# EAGLE design BTS (EAGLE 8.6.0)
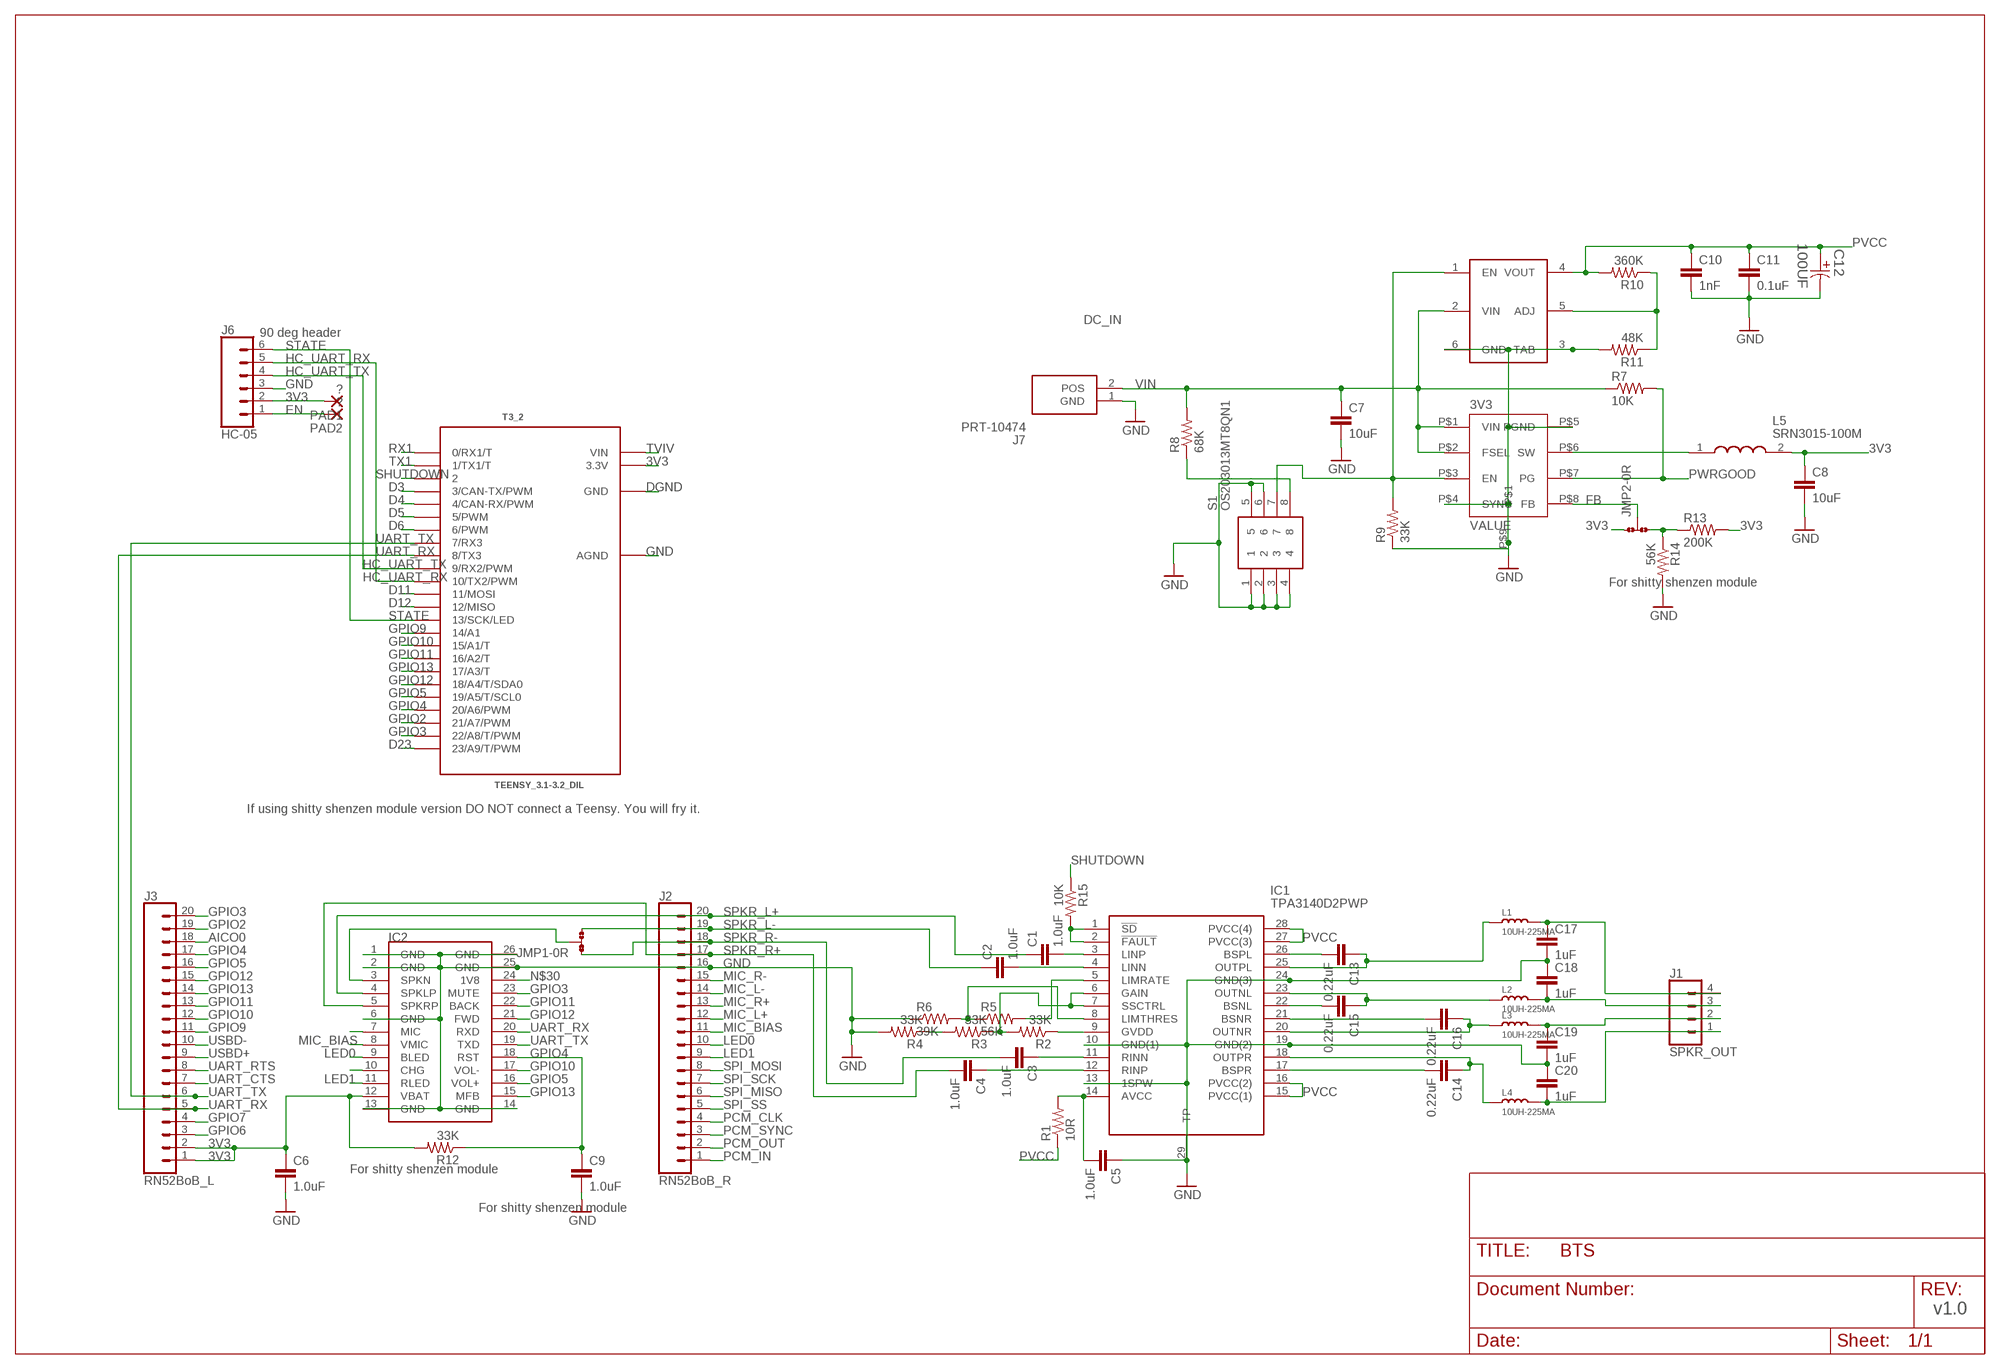
[diagram p0: schematic, sheet 1]

## Parts
3V3  ADP2370  [3MM_LFCSP_QFN]
C1  1.0uF  1.0UF-0603-16V-10%  [0603]
C2  1.0uF  1.0UF-0603-16V-10%  [0603]
C3  1.0uF  1.0UF-0603-16V-10%  [0603]
C4  1.0uF  1.0UF-0603-16V-10%  [0603]
C5  1.0uF  1.0UF-0603-16V-10%  [0603]
C6  1.0uF  1.0UF-0603-16V-10%  [0603]
C7  10uF  C-EUC3216  [C3216]
C8  10uF  C-EUC3216  [C3216]
C9  1.0uF  1.0UF-0603-16V-10%  [0603]
C10  1nF  1.0NF/1000PF-0603-50V-10%  [0603]
C11  0.1uF  0.1UF-0603-25V-(+80/-20%)  [0603]
C12  100UF  EEE-FK1C101P-CASE-D  [CAPAE660X610N]
C13  0.22uF  0.22UF-0603-50V-(-20/+80%)  [0603]
C14  0.22uF  0.22UF-0603-50V-(-20/+80%)  [0603]
C15  0.22uF  0.22UF-0603-50V-(-20/+80%)  [0603]
C16  0.22uF  0.22UF-0603-50V-(-20/+80%)  [0603]
C17  1uF  1.0NF/1000PF-0603-50V-10%  [0603]
C18  1uF  1.0NF/1000PF-0603-50V-10%  [0603]
C19  1uF  1.0NF/1000PF-0603-50V-10%  [0603]
C20  1uF  1.0NF/1000PF-0603-50V-10%  [0603]
IC1  TPA3140D2PWP  [SOP65P640X120-29N]
IC2  BLK-MD-SPK-B  [BLK-MD-SPK-B]
J1  SPKR_OUT  CONN_04SCREW  [SCREWTERMINAL-3.5MM-4]
J2  RN52BoB_R  CONN_20  [1X20]
J3  RN52BoB_L  CONN_20  [1X20]
J6  HC-05  CONN_06SILK_FEMALE_PTH  [1X06]
J7  PRT-10474  [SHDR2W320P716_1X2_1574X813X158]
JMP1  0R-JUMPA  [A0R-JMP]
JMP2  0R-JUMPA  [A0R-JMP]
L1  10UH-225MA  SMD-INDUCTOR-10UH-225MA-10%(0806)  [L0806]
L2  10UH-225MA  SMD-INDUCTOR-10UH-225MA-10%(0806)  [L0806]
L3  10UH-225MA  SMD-INDUCTOR-10UH-225MA-10%(0806)  [L0806]
L4  10UH-225MA  SMD-INDUCTOR-10UH-225MA-10%(0806)  [L0806]
L5  SRN3015-100M  [SRN3015]
PAD1  ?  SMD2  [SMD1,27-2,54]
PAD2  ?  SMD2  [SMD1,27-2,54]
R1  10R  R-US_R0603  [R0603]
R2  33K  R-US_R0603  [R0603]
R3  33K  R-US_R0603  [R0603]
R4  33K  R-US_R0603  [R0603]
R5  56K  R-US_R0603  [R0603]
R6  39K  R-US_R0603  [R0603]
R7  10K  R-US_R0603  [R0603]
R8  68K  R-US_R0603  [R0603]
R9  33K  R-US_R0603  [R0603]
R10  360K  R-US_R0603  [R0603]
R11  48K  R-US_R0603  [R0603]
R12  33K  R-US_R0603  [R0603]
R13  200K  R-US_R0603  [R0603]
R14  56K  R-US_R0603  [R0603]
R15  10K  R-US_R0603  [R0603]
S1  OS203013MT8QN1  [OS203013MT8QN1]
T3_2  TEENSY_3.1-3.2_DIL  [TEENSY_3.0-3.2&LC_DIL]
U$2  NCP59302  [D2PAK-5]

## Nets
3V3: C6.1 C8.1 IC2.12(VBAT) J3.1 J3.2 J6.2 JMP2.1 L5.2 PAD1.1(P) R12.2 R13.2 T3_2.3.3V
AICO0: J3.18
BSNL: C15.2 IC1.22(BSNL)
BSNR: C16.2 IC1.21(BSNR)
BSPL: C13.2 IC1.26(BSPL)
BSPR: C14.2 IC1.17(BSPR)
D3: T3_2.3(3/CAN-TX/PWM)
D4: T3_2.4(4/CAN-RX/PWM)
D5: T3_2.5(5/PWM)
D6: T3_2.6(6/PWM)
D11: T3_2.11(11/MOSI)
D12: T3_2.12(12/MISO)
D23: T3_2.23/A9(23/A9/T/PWM)
DGND: T3_2.GND
EN: J6.1 PAD2.1(P)
FB: 3V3.P$8(FB) JMP2.2
GAIN: IC1.6(GAIN) IC1.7(SSCTRL) R2.2 R3.1
GND: 3V3.P$4(SYNC) 3V3.P$5(PGND) 3V3.P$9 C5.1 C6.2 C7.2 C8.2 C9.2 C10.2 C11.2 C12.2 C17.2 C18.1 C19.2 C20.1 IC1.10(GND(1)) IC1.13(1SPW) IC1.19(GND(2)) IC1.24(GND(3)) IC1.29(TP) IC2.1(GND) IC2.2(GND) IC2.6(GND) IC2.13(GND) IC2.14(GND) IC2.25(GND) IC2.26(GND) J2.16 J6.3 J7.1(GND) R4.2 R6.1 R9.1 R11.2 R14.2 S1.1 S1.2 S1.3 S1.4 S1.5 S1.6 T3_2.AGND U$2.3(TAB) U$2.6(GND)
GPIO2: J3.19 T3_2.21/A7(21/A7/PWM)
GPIO3: IC2.23(MUTE) J3.20 T3_2.22/A8(22/A8/T/PWM)
GPIO4: C9.1 IC2.18(RST) J3.17 R12.1 T3_2.20/A6(20/A6/PWM)
GPIO5: IC2.16(VOL+) J3.16 T3_2.19/A5(19/A5/T/SCL0)
GPIO6: J3.3
GPIO7: J3.4
GPIO9: J3.11 T3_2.14/A0(14/A1)
GPIO10: IC2.17(VOL-) J3.12 T3_2.15/A1(15/A1/T)
GPIO11: IC2.22(BACK) J3.13 T3_2.16/A2(16/A2/T)
GPIO12: IC2.21(FWD) J3.15 T3_2.18/A4(18/A4/T/SDA0)
GPIO13: IC2.15(MFB) J3.14 T3_2.17/A3(17/A3/T)
GVDD: IC1.9(GVDD) R2.1
HC_UART_RX: J6.5 T3_2.10(10/TX2/PWM)
HC_UART_TX: J6.4 T3_2.9(9/RX2/PWM)
LED0: IC2.9(BLED) J2.10
LED1: IC2.11(RLED) J2.9
LIMRATE: IC1.5(LIMRATE) R5.2
LIMTHRES: IC1.8(LIMTHRES) R5.1 R6.2
LINN: C2.2 IC1.4(LINN)
LINP: C1.2 IC1.3(LINP)
MIC_BIAS: IC2.8(VMIC) J2.11
MIC_L+: J2.12
MIC_L-: J2.14
MIC_R+: J2.13
MIC_R-: J2.15
N$1: C5.2 IC1.14(AVCC) R1.2
N$2: IC1.1(!SD) IC1.2(!FAULT) R15.2
N$3: R3.2 R4.1
N$16: IC2.7(MIC)
N$19: C17.1 J1.4 L1.2
N$20: C18.2 J1.3 L2.2
N$21: C19.1 J1.2 L3.2
N$22: C20.2 J1.1 L4.2
N$23: JMP2.3 R13.1 R14.1
N$26: IC2.10(CHG)
N$28: IC2.3(SPKN) JMP1.2
N$30: IC2.24(1V8)
N$63: 3V3.P$3(EN) R9.2 S1.7 U$2.1(EN)
N$64: 3V3.P$6(SW) L5.1
N$65: R8.1 S1.8
N$66: R10.1 R11.1 U$2.5(ADJ)
OUTNL: C15.1 IC1.23(OUTNL) L2.1
OUTNR: C16.1 IC1.20(OUTNR) L3.1
OUTPL: C13.1 IC1.25(OUTPL) L1.1
OUTPR: C14.1 IC1.18(OUTPR) L4.1
PCM_CLK: J2.4
PCM_IN: J2.1
PCM_OUT: J2.2
PCM_SYNC: J2.3
PVCC: C10.1 C11.1 C12.1 IC1.15(PVCC(1)) IC1.16(PVCC(2)) IC1.27(PVCC(3)) IC1.28(PVCC(4)) R1.1 R10.2 U$2.4(VOUT)
PWRGOOD: 3V3.P$7(PG) R7.2
RINN: C3.1 IC1.11(RINN)
RINP: C4.1 IC1.12(RINP)
RX1: T3_2.0(0/RX1/T)
SHUTDOWN: R15.1 T3_2.2
SPI_MISO: J2.6
SPI_MOSI: J2.8
SPI_SCK: J2.7
SPI_SS: J2.5
SPKR_L+: C1.1 IC2.4(SPKLP) J2.20
SPKR_L-: C2.1 J2.19 JMP1.3
SPKR_R+: C4.2 IC2.5(SPKRP) J2.17
SPKR_R-: C3.2 J2.18 JMP1.1
STATE: J6.6 T3_2.13(13/SCK/LED)
TVIV: T3_2.VIN
TX1: T3_2.1(1/TX1/T)
UART_CTS: J3.7
UART_RTS: J3.8
UART_RX: IC2.20(RXD) J3.5 T3_2.8(8/TX3)
UART_TX: IC2.19(TXD) J3.6 T3_2.7(7/RX3)
USBD+: J3.9
USBD-: J3.10
VIN: 3V3.P$1(VIN) 3V3.P$2(FSEL) C7.1 J7.2(POS) R7.1 R8.2 U$2.2(VIN)

## Notes on the sheet
- DC_IN
- 90 deg header
- For shitty shenzen module
- If using shitty shenzen module version DO NOT connect a Teensy. You will fry it.
- For shitty shenzen module
- For shitty shenzen module
- v1.0

## Library data of the parts
3V3 = myLib:ADP2370
C1-C6 C9 = SparkFun-Capacitors:1.0UF: 1µF ceramic capacitors A capacitor is a passive two-terminal electrical component used to store electrical energy temporarily in an electric field.; PROD_ID: CAP-00868
C7 = rcl:C-EU: CAPACITOR, European symbol; SPICEPREFIX: 10uF
C8 = rcl:C-EU: CAPACITOR, European symbol; SPICEPREFIX: C
C10 = SparkFun-Capacitors:1.0NF/1000PF: 1nF/1,000pF ceramic capacitors A capacitor is a passive two-terminal electrical component used to store electrical energy temporarily in an electric field.; PROD_ID: CAP-07886
C11 = SparkFun-Capacitors:0.1UF: 0.1µF ceramic capacitors A capacitor is a passive two-terminal electrical component used to store electrical energy temporarily in an electric field.; PROD_ID: CAP-00810
C12 = Panasonic-EEEFK_EEEFP:EEE-: Aluminum Electrolytic Capacitors,Surface Mount Type; MPN: EEE-FK1C101P; OC_FARNELL: 9695672; OC_NEWARK: 80K9525; PACKAGE: CASE-D; SUPPLIER: PANASONIC; TOLERANCE: ±20 %; VOLTAGERATING: 16V
C13-C16 = SparkFun-Capacitors:0.22UF: 0.22µF ceramic capacitors A capacitor is a passive two-terminal electrical component used to store electrical energy temporarily in an electric field.; PROD_ID: CAP-09885
C17-C20 = SparkFun-Capacitors:1.0NF/1000PF: 1nF/1,000pF ceramic capacitors A capacitor is a passive two-terminal electrical component used to store electrical energy temporarily in an electric field.; PROD_ID: CAP-07886; VALUE: 1nF
IC1 = TPA3140D2PWP:TPA3140D2PWP: Audio Amplifiers 10W Class-D Audio Amp Source: Datasheet <http://www.mouser.com/ds/2/405/tpa3140d2-558212.pdf>; DESCRIPTION: Audio Amplifiers 10W Class-D Audio Amp; HEIGHT: 1.2mm; MANUFACTURER_NAME: Texas Instruments; MANUFACTURER_PART_NUMBER: TPA3140D2PWP; SUPPLIER_NAME: RS
IC2 = BLK-MD-SPK-B:BLK-MD-SPK-B
J1 = SparkFun-Connectors:CONN_04: Multi connection point. Often used as Generic Header-pin footprint for 0.1 inch spaced/style header connections On any of the 0.1 inch spaced packages, you can populate with these: Break Away Headers - Straight <https://www.sparkfun.com/products/116> (PRT-00116) Break Away Male Headers - Right Angle <https://www.sparkfun.com/products/553> (PRT-00553) Female Headers <https://www.sparkfun.com/products/115> (PRT-00115) Break Away Headers - Machine Pin <https://www.sparkfun.com/products/117> (PRT-00117) Break Away Female Headers - Swiss Machine Pin <https://www.sparkfun.com/products/743> (PRT-00743) For SCREWTERMINALS and SPRING TERMINALS visit here: Screw Terimnals on SparkFun.com <https://www.sparkfun.com/search/results?term=Screw+Terminals> (5mm/3.5mm/2.54mm spacing) This device is also useful as a general connection point to wire up your design to another part of your project. Our various solder wires solder well into these plated through hole pads. Hook-Up Wire - Assortment (Stranded, 22 AWG) <https://www.sparkfun.com/products/11375> (PRT-11375) Hook-Up Wire - Assortment (Solid Core, 22 AWG) <https://www.sparkfun.com/products/11367> (PRT-11367) View the entire wire category on our website here <https://www.sparkfun.com/categories/141> Special notes: Molex polarized connector foot print use with SKU : PRT-08231 with associated crimp pins and housings. 1MM SMD Version SKU: PRT-10208; PROD_ID: 2xCONN-08399; SF_ID: 2xPRT-08084
J2 J3 = SparkFun-Connectors:CONN_20: Multi connection point. Often used as Generic Header-pin footprint for 0.1 inch spaced/style header connections On any of the 0.1 inch spaced packages, you can populate with these: Break Away Headers - Straight <https://www.sparkfun.com/products/116> (PRT-00116) Break Away Male Headers - Right Angle <https://www.sparkfun.com/products/553> (PRT-00553) Female Headers <https://www.sparkfun.com/products/115> (PRT-00115) Break Away Headers - Machine Pin <https://www.sparkfun.com/products/117> (PRT-00117) Break Away Female Headers - Swiss Machine Pin <https://www.sparkfun.com/products/743> (PRT-00743) For SCREWTERMINALS and SPRING TERMINALS visit here: Screw Terimnals on SparkFun.com <https://www.sparkfun.com/search/results?term=Screw+Terminals> (5mm/3.5mm/2.54mm spacing) This device is also useful as a general connection point to wire up your design to another part of your project. Our various solder wires solder well into these plated through hole pads. Hook-Up Wire - Assortment (Stranded, 22 AWG) <https://www.sparkfun.com/products/11375> (PRT-11375) Hook-Up Wire - Assortment (Solid Core, 22 AWG) <https://www.sparkfun.com/products/11367> (PRT-11367) View the entire wire category on our website here <https://www.sparkfun.com/categories/141> Special notes: Molex polarized connector foot print use with SKU : PRT-08231 with associated crimp pins and housings. 1MM SMD Version SKU: PRT-10208 NOTES ON THE VARIANTS LOCK and LOCK_LONGPADS... This footprint was designed to help hold the alignment of a through-hole component (i.e. 6-pin header) while soldering it into place. You may notice that each hole has been shifted either up or down by 0.005 of an inch from it's more standard position (which is a perfectly straight line). This slight alteration caused the pins (the squares in the middle) to touch the edges of the holes. Because they are alternating, it causes a "brace" to hold the component in place. 0.005 has proven to be the perfect amount of "off-center" position when using our standard breakaway headers. Although looks a little odd when you look at the bare footprint, once you have a header in there, the alteration is very hard to notice. Also,if you push a header all the way into place, it is covered up entirely on the bottom side. Note about LOCK SPECIAL package: This is just like the LOCK variant in that the holes are staggared by 5 mil, but except for the last two holes. They are not altered from the "standard" footprint layout. This is used for a special purpose on the layout of our Graphic LCD Backpack. Make sure you want to use this device before selecting it for you project!
J6 = SparkFun-Connectors:CONN_06: Multi connection point. Often used as Generic Header-pin footprint for 0.1 inch spaced/style header connections On any of the 0.1 inch spaced packages, you can populate with these: Break Away Headers - Straight <https://www.sparkfun.com/products/116> (PRT-00116) Break Away Male Headers - Right Angle <https://www.sparkfun.com/products/553> (PRT-00553) Female Headers <https://www.sparkfun.com/products/115> (PRT-00115) Break Away Headers - Machine Pin <https://www.sparkfun.com/products/117> (PRT-00117) Break Away Female Headers - Swiss Machine Pin <https://www.sparkfun.com/products/743> (PRT-00743) Arduino Stackable Header - 6 Pin <https://www.sparkfun.com/products/9280> (PRT-09280) For SCREWTERMINALS and SPRING TERMINALS visit here: Screw Terimnals on SparkFun.com <https://www.sparkfun.com/search/results?term=Screw+Terminals> (5mm/3.5mm/2.54mm spacing) This device is also useful as a general connection point to wire up your design to another part of your project. Our various solder wires solder well into these plated through hole pads. Hook-Up Wire - Assortment (Stranded, 22 AWG) <https://www.sparkfun.com/products/11375> (PRT-11375) Hook-Up Wire - Assortment (Solid Core, 22 AWG) <https://www.sparkfun.com/products/11367> (PRT-11367) View the entire wire category on our website here <https://www.sparkfun.com/categories/141>; PROD_ID: CONN-08437
J7 = PRT-10474:PRT-10474: Soldering Workstation Equipment XT60 Connectors Male/Female Pair Source: Datasheet <http://cdn.sparkfun.com/datasheets/Prototyping/xt60.pdf>; DESCRIPTION: Soldering Workstation Equipment XT60 Connectors Male/Female Pair; HEIGHT: 15.875mm; MANUFACTURER_NAME: SparkFun; MANUFACTURER_PART_NUMBER: PRT-10474; SUPPLIER_NAME: RS
JMP1 JMP2 = jump-0r-smd:0R-JUMP: SMD 0R 0805 Jumper
L1-L4 = Seeed-Inductor:SMD-INDUCTOR-10UH-225MA-10%(0806): 303010042; MPN: LQH2MCN100K02L
L5 = SRN3015-100M:SRN3015-100M: Power Inductor semi-shielded SMD 10uH Bourns SRN3015 Series Shielded Wire-wound SMD Inductor with a Ferrite Core, 10 H 20% Wire-Wound 1A Idc Source: Datasheet <https://componentsearchengine.com/Datasheets/3/SRN3015-100M.pdf>; DESCRIPTION: Power Inductor semi-shielded SMD 10uH Bourns SRN3015 Series Shielded Wire-wound SMD Inductor with a Ferrite Core, 10 H 20% Wire-Wound 1A Idc; HEIGHT: mm; MANUFACTURER_NAME: Bourns; MANUFACTURER_PART_NUMBER: SRN3015-100M; RS_PART_NUMBER: 7435071; SUPPLIER_NAME: RS
PAD1 PAD2 = wirepad:SMD2: SMD PAD
R1 = resistor:R-US_: RESISTOR, American symbol; RESISTANCE: 10R
R2-R4 R9 R12 R15 = resistor:R-US_: RESISTOR, American symbol; RESISTANCE: 33K
R5 = resistor:R-US_: RESISTOR, American symbol; RESISTANCE: 56K
R6 = resistor:R-US_: RESISTOR, American symbol; RESISTANCE: 39K
R7 R10 R11 R13 R14 = resistor:R-US_: RESISTOR, American symbol; RESISTANCE: 10K
R8 = resistor:R-US_: RESISTOR, American symbol; RESISTANCE: 68K
S1 = OS203013MT8QN1:OS203013MT8QN1: OS Series Miniature Slide Switches, DP3T. Source: Datasheet <http://www.ckswitches.com/media/1428/os.pdf>; DESCRIPTION: OS Series Miniature Slide Switches, DP3T.; HEIGHT: mm; MANUFACTURER_NAME: C & K COMPONENTS; MANUFACTURER_PART_NUMBER: OS203013MT8QN1; SUPPLIER_NAME: RS
T3_2 = Teensy_3_and_LC_Series_Boards_v1.4:TEENSY_3.1-3.2_DIL: Teensy 3.1 or 3.2 in a DIL Layout.
U$2 = myLib:NCP59302

## Board
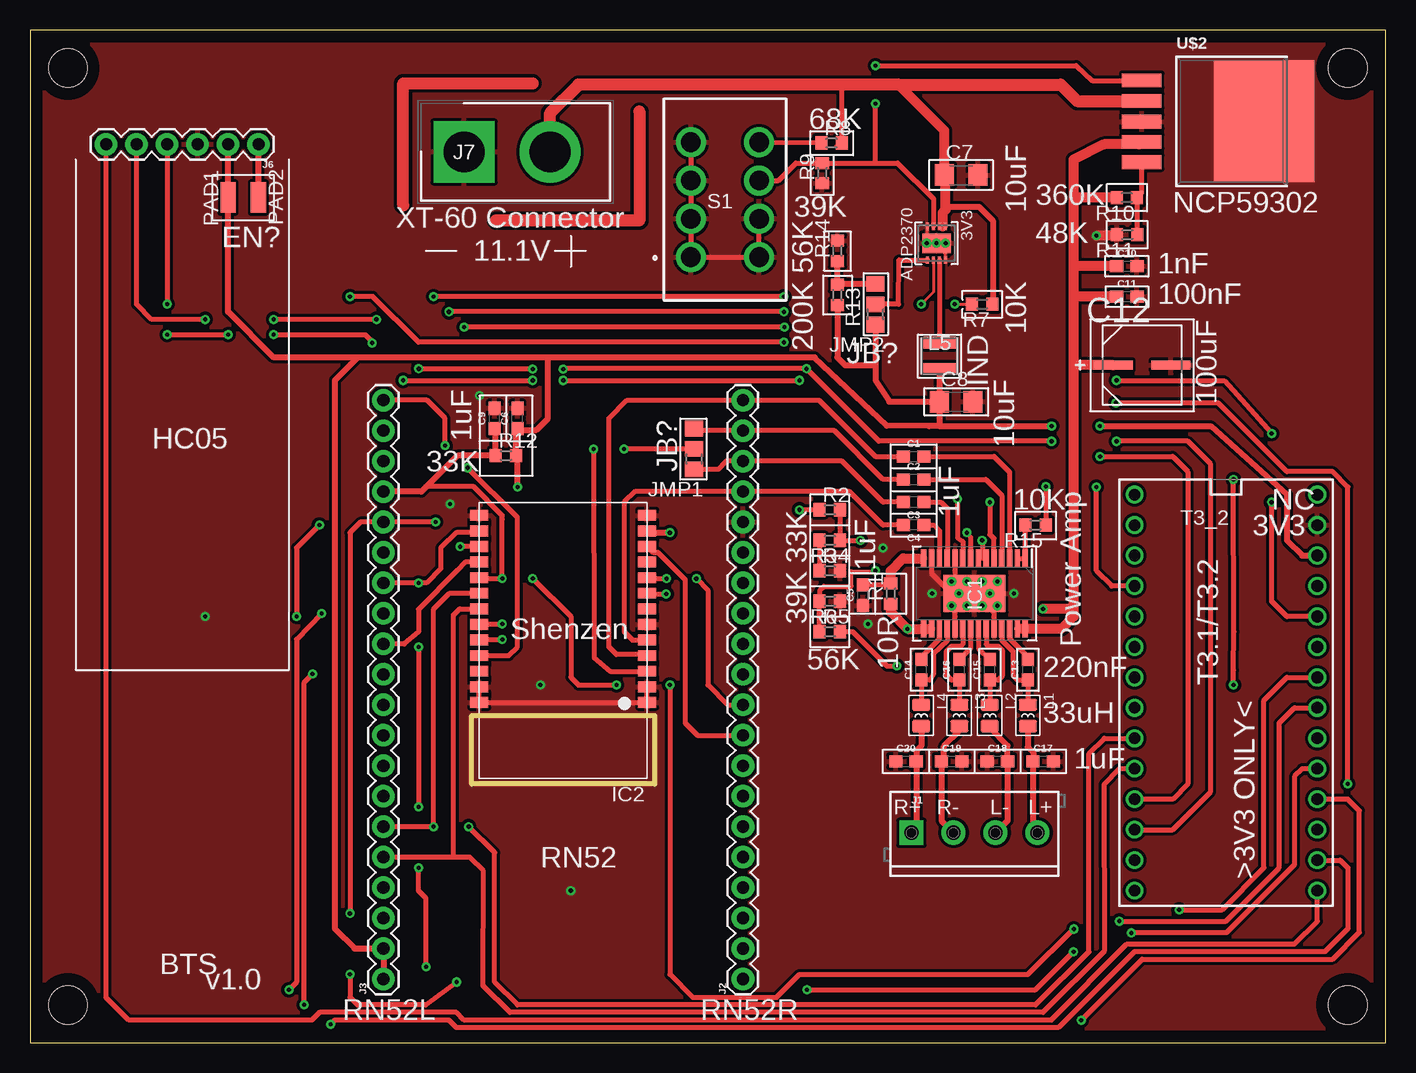
[diagram p1: board, top side]
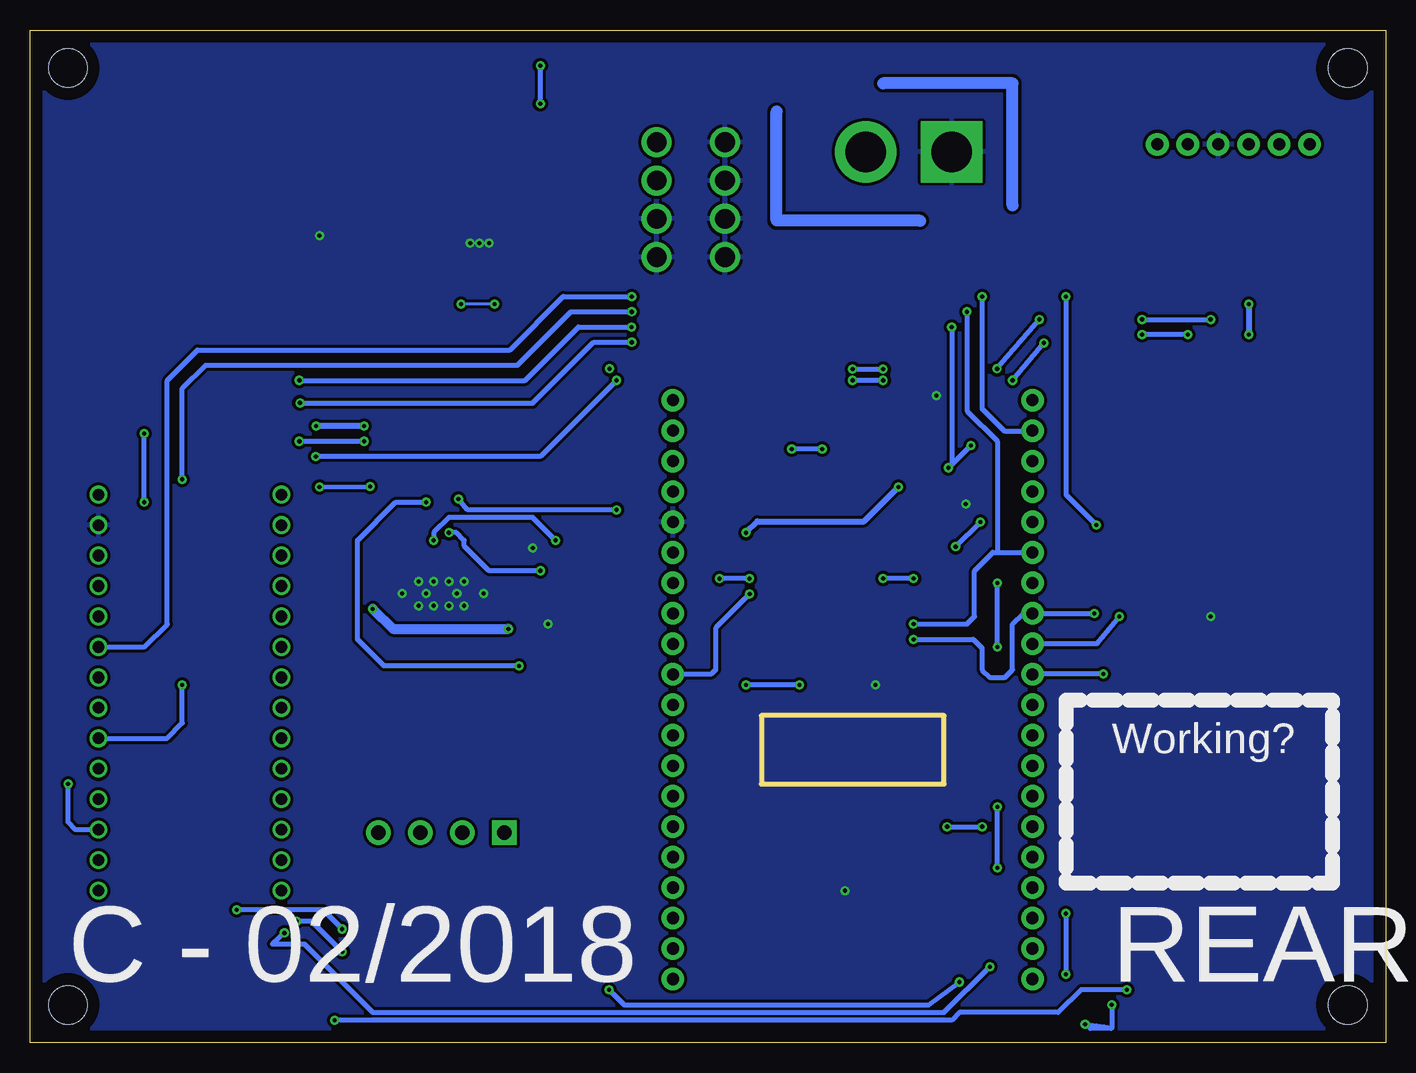
[diagram p2: board, bottom side, seen from below]

Size 113.03 x 84.46 mm. Coordinates in mm from the lower left corner, seen from the top.
Outline: 0,0 113.03,0 113.03,84.46 0,84.45 0,0
Copper layers (1*16): Top 0.035mm / dielectric 1.5mm / Bottom 0.035mm
Design rules "PCBCart *": minimum track width 6mil, minimum drill 8mil, track to track 6mil, track to pad 6mil, pad to pad 6mil, via to via 6mil, smd to smd 6mil, copper to edge 40mil, drill to drill 6mil, minimum pad ring 10mil, minimum via ring 8mil, stop-mask expansion 5mil, vias tented up to drill 0mil, thermal gap 10mil
Holes 3.2 mm at 3.17,81.28 109.86,81.28 3.17,3.17 109.86,3.17
Milling: area 36.8,21.6 to 52.1,27.3

### Footprints (pad centres in the part's own frame; a part is rotated, then mirrored left to right if it is on the bottom)
3MM_LFCSP_QFN = smd 0.6 x 0.25: P$1 -1.4,0.75; P$2 -1.4,0.25; P$3 -1.4,-0.25; P$4 -1.4,-0.75; P$5 1.4,0.75; P$6 1.4,0.25; P$7 1.4,-0.25; P$8 1.4,-0.75 | smd 1.64 x 2.38: P$9 0,0
0603 = smd 1.1 x 1: 1 -0.85,0; 2 0.85,0
C3216 = smd 1.6 x 1.8: 1 -1.4,0; 2 1.4,0
CAPAE660X610N = smd 3.251 x 0.762: 1 -2.413,0; 2 2.413,0
SOP65P640X120-29N = smd 1.475 x 0.45: 1 -2.938,4.225; 2 -2.938,3.575; 3 -2.938,2.925; 4 -2.938,2.275; 5 -2.938,1.625; 6 -2.938,0.975; 7 -2.938,0.325; 8 -2.938,-0.325; 9 -2.938,-0.975; 10 -2.938,-1.625; 11 -2.938,-2.275; 12 -2.938,-2.925; 13 -2.938,-3.575; 14 -2.938,-4.225; 15 2.938,-4.225; 16 2.938,-3.575; 17 2.938,-2.925; 18 2.938,-2.275; 19 2.938,-1.625; 20 2.938,-0.975; 21 2.938,-0.325; 22 2.938,0.325; 23 2.938,0.975; 24 2.938,1.625; 25 2.938,2.275; 26 2.938,2.925; 27 2.938,3.575; 28 2.938,4.225 | smd 3.1 x 5.18: 29 0,0
BLK-MD-SPK-B = smd 1.5 x 0.9: 1 -7,7.8; 2 -7,6.5; 3 -7,5.2; 4 -7,3.9; 5 -7,2.6; 6 -7,1.3; 7 -7,0; 8 -7,-1.3; 9 -7,-2.6; 10 -7,-3.9; 11 -7,-5.2; 12 -7,-6.5; 13 -7,-7.8; 14 7,-7.8; 15 7,-6.5; 16 7,-5.2; 17 7,-3.9; 18 7,-2.6; 19 7,-1.3; 20 7,0; 21 7,1.3; 22 7,2.6; 23 7,3.9; 24 7,5.2; 25 7,6.5; 26 7,7.8
SCREWTERMINAL-3.5MM-4 = drill 1.2 pad 2.032 square: 1 0,0 | drill 1.2 pad 2.032: 2 3.5,0; 3 7,0; 4 10.5,0
1X20 = drill 1.016 pad 1.88: 1 0,0; 2 2.54,0; 3 5.08,0; 4 7.62,0; 5 10.16,0; 6 12.7,0; 7 15.24,0; 8 17.78,0; 9 20.32,0; 10 22.86,0; 11 25.4,0; 12 27.94,0; 13 30.48,0; 14 33.02,0; 15 35.56,0; 16 38.1,0; 17 40.64,0; 18 43.18,0; 19 45.72,0; 20 48.26,0
1X06 = drill 1.016 pad 1.88: 1 0,0; 2 2.54,0; 3 5.08,0; 4 7.62,0; 5 10.16,0; 6 12.7,0
SHDR2W320P716_1X2_1574X813X158 = drill 3.4 pad 5.1 square: 1 0,0 | drill 3.4 pad 5.1: 2 7.163,0
A0R-JMP = smd 1.5 x 1.3: 1 0,1.7; 2 0,0; 3 0,-1.7
L0806 = smd 1.016 x 1.524: 1 -0.889,0; 2 0.889,0
SRN3015 = smd 2.7 x 1: 1 0,-1.1; 2 0,1.1
SMD1,27-2,54 = smd 1.27 x 2.54: 1 0,0
R0603 = smd 1 x 1.1: 1 -0.85,0; 2 0.85,0
OS203013MT8QN1 = drill 1.65 pad 2.5: 1 -2.85,-4.8; 2 -2.85,-1.6; 3 -2.85,1.6; 4 -2.85,4.8; 5 2.85,-4.8; 6 2.85,-1.6; 7 2.85,1.6; 8 2.85,4.8
TEENSY_3.0-3.2&LC_DIL = drill 0.965: 0 -7.62,13.97; 1 -7.62,11.43; 2 -7.62,8.89; 3 -7.62,6.35; 3.3V 7.62,11.43; 4 -7.62,3.81; 5 -7.62,1.27; 6 -7.62,-1.27; 7 -7.62,-3.81; 8 -7.62,-6.35; 9 -7.62,-8.89; 10 -7.62,-11.43; 11 -7.62,-13.97; 12 -7.62,-16.51; 13 7.62,-16.51; 14/A0 7.62,-13.97; 15/A1 7.62,-11.43; 16/A2 7.62,-8.89; 17/A3 7.62,-6.35; 18/A4 7.62,-3.81; 19/A5 7.62,-1.27; 20/A6 7.62,1.27; 21/A7 7.62,3.81; 22/A8 7.62,6.35; 23/A9 7.62,8.89; AGND 7.62,13.97; GND -7.62,16.51; VIN 7.62,16.51
D2PAK-5 = smd 1.143 x 3.302: 1 -3.404,-7.658; 2 -1.702,-7.658; 4 1.702,-7.658; 5 3.404,-7.658; 6 0.025,-7.658 | smd 10.16 x 8.382: 3 0,2.54

### Placement (x,y rotation side)
3V3  75.56,66.67 270 top
C1  73.66,48.9 0 top
C2  73.66,46.99 0 top
C3  73.66,45.09 180 top
C4  73.66,43.18 180 top
C5  69.44,37.34 90 top
C6  40.64,52.07 90 top
C7  77.62,72.36 0 top
C8  77.22,53.47 0 top
C9  38.73,52.07 90 top
C10  91.44,64.77 0 top
C11  91.44,62.23 0 top
C12  92.71,56.52 0 top
C13  83.19,31.11 90 top
C14  74.3,31.11 90 top
C15  80.01,31.11 90 top
C16  77.47,31.11 90 top
C17  84.45,23.5 0 top
C18  80.64,23.5 0 top
C19  76.83,23.5 0 top
C20  73.03,23.5 0 top
IC1  78.74,37.47 270 top
IC2  44.45,36.2 180 top
J1  73.48,17.53 0 top
J2  59.44,5.33 90 top
J3  29.46,5.33 90 top
J6  19.05,74.93 180 top
J7  36.2,74.3 0 top
JMP1  55.37,49.53 180 top
JMP2  70.48,61.59 180 top
L1  83.19,27.3 270 top
L2  80.01,27.3 270 top
L3  77.47,27.3 270 top
L4  74.3,27.3 270 top
L5  75.82,57.28 180 top
PAD1  16.51,70.48 0 top
PAD2  19.05,70.48 180 top
R1  71.75,37.47 90 top
R2  66.67,44.45 0 top
R3  66.67,41.91 180 top
R4  66.67,39.37 0 top
R5  66.67,34.29 0 top
R6  66.67,36.83 180 top
R7  79.38,61.59 180 top
R8  66.83,75.03 0 top
R9  66.04,72.52 90 top
R10  91.44,70.48 180 top
R11  91.47,67.39 180 top
R12  39.67,48.97 0 top
R13  67.31,62.36 270 top
R14  67.31,66.04 90 top
R15  83.82,43.18 180 top
S1  57.94,70.31 0 top
T3_2  99.69,29.21 0 top
U$2  100.33,76.83 270 top

### Tracks (layer width: path | path; a pad name or v marks a point on that pad's centre or on a via)
3V3  (via drill 0.35)
  Top 0.254: C8.1
  Top 0.508: JMP2.1 70.48,56.52 | 70.48,56.52 70.48,55.24 71.63,53.47 C8.1 75.82,51.43 | R13.2 67.31,57.15 67.94,56.52 70.48,56.52 | L5.2 C8.1 | 43.18,57.15 65.41,57.15 71.42,51.46 74.95,51.44 75.82,51.43 | 43.18,57.15 27.3,57.15 | J6.2 PAD1.1 16.51,60.96 20.32,57.15 27.3,57.15 | 27.3,57.15 25.4,55.24 25.4,9.53 27.05,7.87 J3.2 J3.1 | IC2.12 51.6,42.55 v53.34,42.55 | v40.64,46.35 40.64,48.86 R12.2 40.52,51.1 | 40.52,51.1 C6.1 | 40.52,51.1 42.22,51.1 43.18,52.07 43.18,57.15 | 75.82,51.43 76.85,51.44 v85.17,51.44 | v89.18,51.44 98.42,51.44 104.78,45.74 104.78,41.91 106.05,40.64 T3_2.3.3V
  Bottom 0.508: v53.34,42.55 52.39,43.5 43.5,43.5 v40.64,46.35 | v85.17,51.44 v89.18,51.44
BSNL
  Top 0.406: IC1.22 79.06,32.91 C15.2
BSNR
  Top 0.406: IC1.21 78.42,32.91 C16.2
BSPL
  Top 0.406: IC1.26 81.69,34.51 81.69,33.69 83.19,32.19 C13.2
BSPR
  Top 0.406: IC1.17 75.79,34.51 75.79,33.69 74.3,32.19 C14.2
EN
  Top 0.508: PAD2.1 J6.1
FB
  Top 0.406: JMP2.2 72.42,61.59 72.43,65.27 72.44,65.28 3V3.P$8
GAIN  (via drill 0.35)
  Top 0.406: v69.22,41.91 R3.1 R2.2 | v79.38,41.91 79.38,40.74 IC1.6 IC1.7
  Bottom 0.406: v69.22,41.91 71.12,43.81 78.11,43.81 79.38,42.55 v79.38,41.91
GND  (via drill 0.35)
  Top 0.152: 77.11,35.56 77.11,35.84 IC1.29 77.11,39.09 77.11,39.37
  Top 0.254: 3V3.P$9 v74.75,66.67 | 3V3.P$9 76.2,66.67 v76.33,66.67 v76.32,66.67 76.32,65.92 | 3V3.P$9 74.81,67.42 3V3.P$4 | 3V3.P$9 76.32,65.92 | 76.32,65.92 76.32,65.28 3V3.P$5
  Top 0.406: S1.4 S1.3 S1.2 S1.1 S1.5 S1.6 | IC1.19 77.11,35.56 77.11,35.88 | IC1.10 77.11,39.37 77.11,39.05 | IC1.13 75.17,39.13 76.37,37.93 | IC1.24 80.36,35.88 78.78,37.47 IC1.29 | IC2.25 IC2.26 IC2.1 IC2.2 | IC1.29 v78.11,38.48 | IC1.29 v79.38,38.48 | IC1.29 v80.01,37.47 | IC1.29 v78.11,36.45 | IC1.29 v79.38,36.45 | 76.31,66.56 76.2,66.67 | 74.81,66.74 v74.75,66.67
  Top 0.813: R11.2 90.54,67.31 v88.9,67.31
  other vias: 75.56,66.67 76.83,38.48 75.21,37.47 76.83,36.45 77.44,37.47 80.64,38.48 82.02,37.47 80.64,36.45 14.61,35.56 35.03,44.93 37.47,53.98 69.85,34.92 71.12,41.27 42.55,29.84 45.09,12.7
  pour Top: 74.83,38.84 82.32,38.84 82.32,36.07 74.8,36.07 74.8,38.81
  pour Top (isolate 0.254): 0,84.45 113.03,84.45 113.03,0 0,0
  pour Bottom (isolate 0.254): 0,84.45 0,0 113.03,0 113.03,84.45
GPIO2  (via drill 0.35)
  Top 0.406: v62.87,62.23 v33.66,62.23
  Bottom 0.406: T3_2.21/A7 103.5,33.02 101.58,34.9 101.58,55.24 99.06,57.78 73.03,57.78 68.58,62.23 v62.87,62.23 | v33.66,62.23 33.66,52.88 31.8,51.03 29.49,51.03 J3.19
GPIO3  (via drill 0.35)
  Top 0.406: IC2.23 39.91,32.3 40.64,33.02 40.64,43.81 v36.47,47.95 | v34.59,49.81 34.59,52.09 33.1,53.59 J3.20 | T3_2.22/A8 104.78,35.56 103.5,36.83 v103.5,45.09 | v62.89,59.69 v36.2,59.69 | v90.58,55.24 99.54,55.22 v103.5,50.8
  Bottom 0.406: v34.59,49.81 v36.47,47.95 36.18,48.24 v36.2,59.69 | v103.5,45.09 v103.5,50.8 | v90.58,55.24 71.75,55.24 67.31,59.69 v62.89,59.69
GPIO4  (via drill 0.35)
  Top 0.406: IC2.18 37.51,38.73 v39.37,38.73 39.37,43.66 | 39.37,43.66 39.37,43.91 | 39.37,43.66 39.37,43.99 36.98,46.38 33.05,46.38 33.02,46.35 | v41.91,38.73 45.09,35.56 45.09,30.48 45.72,29.84 v48.9,29.84 | v53.34,29.84 53.34,5.71 55.24,3.81 62.23,3.81 64.14,5.71 83.19,5.71 v87.02,9.5 | v95.8,11.11 99.38,11.11 102.87,14.61 102.87,28.57 104.78,30.48 T3_2.20/A6
  Top 0.508: C9.1 38.83,51.13 R12.1 35.64,48.97 33.02,46.35 32.64,45.97 J3.17
  Bottom 0.406: v39.37,38.73 v41.91,38.73 | v48.9,29.84 v53.34,29.84 | v87.02,9.5 88.58,11.11 | 88.58,11.11 88.59,11.12 | 88.58,11.11 v95.8,11.11
GPIO5  (via drill 0.35)
  Top 0.406: v26.67,5.71 26.67,3.81 27.3,3.17 33.02,3.17 v35.56,5.08 | v87,7.59 83.82,4.45 v64.77,4.45 | v90.81,10.16 99.69,10.16 104.14,14.61 104.14,26.67 105.41,27.94 T3_2.19/A5 | v26.67,10.79 26.67,42.55 27.56,43.43 J3.16 v33.81,43.43 | IC2.16 35.88,41.4 v35.87,41.38
  Bottom 0.406: v26.67,10.79 v26.67,5.71 | v64.77,4.45 63.5,3.17 38.1,3.17 v35.56,5.08 | v87,7.59 89.53,10.16 v90.81,10.16 | v35.87,41.38 v33.81,43.43
GPIO9  (via drill 0.35)
  Top 0.406: T3_2.14/A0 109.22,15.24 109.86,14.61 109.86,9.53 107.95,7.62 92.08,7.62 85.73,1.27 82.57,1.27 35.56,1.27 34.92,1.91 25.4,1.91 v25.07,1.57 | v22.86,3.17 22.86,30.07 v23.55,30.76
  Bottom 0.406: 22.84,1.27 22.84,3.15 v22.86,3.17 | v23.55,30.76 29.44,30.76 J3.11 | v25.07,1.57 22.84,1.27 | 22.84,1.27 22.89,1.22 24.66,1.22
GPIO10  (via drill 0.35)
  Top 0.406: IC2.17 37.36,40.08 36.27,40.08 35.59,39.39 32.38,36.16 32.38,34.27 31.19,33.25 30.48,33.27 J3.12 | v109.86,21.59 109.86,46.35 108.61,47.62 104.78,47.62 99.06,53.37 v90.53,53.37 | v62.87,58.42 32.38,58.42 28.57,62.23 v26.67,62.23 | v22.23,35.56 22.23,41.27 v24.13,43.18
  Bottom 0.406: T3_2.15/A1 109.22,17.78 109.86,18.41 v109.86,21.59 | v90.53,53.37 71.12,53.34 66.04,58.42 v62.87,58.42 | v26.67,62.23 26.67,45.72 v24.13,43.18 | v22.23,35.56 24.13,33.27 J3.12
GPIO11  (via drill 0.35)
  Top 0.406: v24.31,35.81 22.23,33.66 22.23,5.08 v21.59,4.45 | v87.63,1.91 92.71,6.99 108.58,6.99 110.82,9.22 110.82,19.36 109.86,20.32 T3_2.16/A2 | IC2.22 37.51,33.66 v39.37,33.66
  Bottom 0.406: v24.31,35.81 J3.13 30.23,35.81 31.11,34.92 31.11,31.11 31.75,30.48 33.02,30.48 33.66,31.11 33.66,32.92 34.39,33.66 v39.37,33.66 | v21.59,4.45 25.4,4.45 27.3,2.54 35.56,2.54 36.2,1.91 v87.63,1.91
GPIO12  (via drill 0.35)
  Top 0.406: IC2.21 37.48,34.92 v39.37,34.92 | v100.33,29.84 100.33,31.09 100.36,34.29 v100.33,46.99 | v62.87,60.96 v34.92,60.96
  Bottom 0.406: v39.37,34.92 34.92,34.92 34.29,35.56 34.29,39.37 32.77,40.89 32.38,40.89 | 32.38,40.89 J3.15 | T3_2.18/A4 101.6,25.4 100.33,26.67 v100.33,29.84 | v100.33,46.99 100.33,54.59 98.4,56.52 72.39,56.52 67.94,60.96 v62.87,60.96 | v34.92,60.96 34.92,52.7 32.38,50.16 32.38,40.89
GPIO13  (via drill 0.35)
  Top 0.406: IC2.15 37.3,42.55 35.56,42.55 34.24,41.27 34.24,39.55 33.05,38.35 v32.38,38.35 J3.14 | T3_2.17/A3 106.05,22.86 105.41,22.23 105.41,14.86 99.75,9.2 91.85,9.2 v91.82,9.17 | v33.02,6.35 33.02,12.06 32.38,12.7 v32.38,14.61 | v32.38,33.02 v32.38,19.68
  Bottom 0.406: v91.82,9.17 92.81,8.26 90.17,8.26 84.45,2.54 36.83,2.54 v33.02,6.35 | v32.38,14.61 v32.38,19.68 | v32.38,33.02 v32.38,38.35
GVDD  (via drill 0.35)
  Top 0.406: R2.1 v64.14,44.45 | IC1.9 77.77,41.83 77.32,42.12 77.32,42.84 77.32,43.45 v77.32,45.36
  Bottom 0.406: v64.14,44.45 76.53,44.45 v77.32,45.36
HC_UART_RX  (via drill 0.35)
  Top 0.406: v14.61,60.33 10.16,60.33 8.89,61.59 J6.5 | v28.88,60.33 v20.32,60.33 | T3_2.10 95.25,17.78 98.42,20.95 98.42,48.26 96.52,50.16 v90.58,50.16 | v85.17,50.16 70.76,50.16 v64.72,56.21 44.42,56.21 v44.45,56.19 | v41.91,56.19 32.44,56.19 v32.41,56.21
  Bottom 0.406: v32.41,56.21 v28.88,60.33 | v90.58,50.16 v85.17,50.16 | v20.32,60.33 v14.61,60.33 | v44.45,56.19 v41.91,56.19
HC_UART_TX  (via drill 0.35)
  Top 0.406: J6.4 v11.43,61.59 | v11.43,59.05 v16.51,59.05 | v20.32,59.05 27.94,59.05 28.51,58.48 | v31.11,55.24 v41.91,55.24 | v44.45,55.24 v64.14,55.24 | v89.2,48.9 95.25,48.9 96.52,47.62 96.52,21.59 95.25,20.32 T3_2.9
  Top 0.508: 28.51,58.48 v28.51,58.37
  Bottom 0.406: v64.14,55.24 70.48,48.9 v89.2,48.9 | v31.11,55.24 v28.51,58.37 | v16.51,59.05 v20.32,59.05 | v41.91,55.24 v44.45,55.24
  Bottom 0.508: v11.43,61.59 v11.43,59.05
LED0  (via drill 0.35)
  Top 0.406: IC2.9 51.53,38.71 v53.06,38.71 | v55.55,38.71 56.52,37.74 56.52,29.84 58.17,28.19 J2.10
  Bottom 0.406: v53.06,38.71 v55.55,38.71
LED1
  Top 0.406: IC2.11 51.94,40.9 52.35,40.9 54.61,38.64 54.61,26.67 55.63,25.65 J2.9
LIMRATE  (via drill 0.35)
  Top 0.406: R5.2 68.58,34.29 71.45,31.42 72.24,31.42 v72.26,31.45 | v80.01,45.09 80.01,42.39 80.37,42.06 IC1.5
  Bottom 0.406: v72.26,31.45 83.52,31.45 85.72,33.66 85.72,41.91 82.55,45.09 v80.01,45.09
LIMTHRES  (via drill 0.35)
  Top 0.406: v78.11,42.55 78.41,42.16 IC1.8 | R5.1 R6.2 65.86,36.87 65.86,37.77 66.17,38.08 68.45,38.08 68.45,39.24 68.48,39.27 70.38,39.27 v70.48,39.37
  Bottom 0.406: v78.11,42.55 77.47,42.55 76.83,41.91 76.83,41.45 74.75,39.37 v70.48,39.37
LINN
  Top 0.406: IC1.4 81.02,45.66 79.68,46.99 C2.2
LINP
  Top 0.406: C1.2 80.37,48.9 81.67,47.6 IC1.3
MIC_BIAS  (via drill 0.35)
  Top 0.406: IC2.8 51.51,37.44 v53.03,37.44
  Bottom 0.406: v53.03,37.44 55.88,34.59 55.88,31.11 56.26,30.73 J2.11
N$1
  Top 0.152: IC1.14 73.66,40.4
  Top 0.406: R1.2 71.63,38.19 C5.2
  Top 0.813: R1.2 71.75,39.37 72.79,40.4 73.66,40.4 74.38,40.4
N$2
  Top 0.406: R15.2 IC1.1 IC1.2
N$3
  Top 0.406: R3.2 R4.1
N$15
  Bottom 1.016: 31.11,69.85 31.11,80.01 41.91,80.01
N$17
  Bottom 1.016: 38.84,68.56 50.8,68.58 50.8,77.65
N$19
  Top 0.508: L1.2 83.19,24.66 83.64,24.21 83.64,23.53 C17.1 83.61,17.9 J1.4
N$20
  Top 0.508: L2.2 80.01,26.26 81.5,24.78 C18.2 81.5,18.54 J1.3
N$21
  Top 0.508: L3.2 77.47,26.04 76.2,24.77 76.2,23.71 C19.1 75.98,18.52 J1.2
N$22
  Top 0.508: L4.2 74.3,24.77 73.88,24.34 C20.2 73.88,17.92 J1.1
N$23
  Top 0.152: R13.1 67.4,63.3
  Top 0.508: R13.1 R14.1 | 67.4,63.3 JMP2.3
N$25
  Top 1.016: 31.11,69.85 31.11,80.01 41.91,80.01
N$27
  Top 1.016: 50.8,77.65 50.8,68.58 38.84,68.58
N$28  (via drill 0.35)
  Top 0.406: JMP1.2 v49.53,49.53 | v46.99,49.53 47.04,32.13 48.38,31 IC2.3
  Bottom 0.406: v46.99,49.53 v49.53,49.53
N$63  (via drill 0.35)
  Top 0.406: S1.7 62.38,71.91 63.84,73.37 R9.2 70.48,73.37 | 70.48,73.37 72.33,73.37 75.31,70.38 3V3.P$3 | 70.48,73.37 v70.48,78.31 | U$2.1 88.54,80.24 87.22,81.48 v70.48,81.48
  Bottom 0.406: v70.48,78.31 v70.48,81.48
N$64
  Top 0.406: 3V3.P$6 L5.1
  Top 0.457: L5.1
N$65
  Top 0.254: 60.84,75.06 S1.8
  Top 0.406: R8.1 60.84,75.06
N$66
  Top 0.305: 92.31,70.46 R10.1 92.67,70.87
  Top 0.406: R11.1 92.31,70.46 | 92.67,70.87 U$2.5
OUTNL
  Top 0.406: IC1.23 79.72,33.24 79.86,33.1 80.7,33.1 81.05,32.74 81.05,30.61 80.71,30.27 C15.1 L2.1
OUTNR
  Top 0.406: IC1.20 77.77,33.24 77.62,33.1 76.83,33.1 76.38,32.64 76.35,30.73 76.82,30.27 C16.1 L3.1
OUTPL
  Top 0.406: IC1.25 81.02,33.57 81.94,32.65 81.94,30.63 82.31,30.27 C13.1 L1.1
OUTPR
  Top 0.406: IC1.18 76.47,34.51 76.47,33.53 75.31,32.42 75.31,30.73 75.02,30.27 C14.1 L4.1
PVCC  (via drill 0.35)
  Top 0.406: IC1.15 74.52,34.52 75.02,34.52 75.16,34.52 IC1.16 | IC1.27 IC1.28
  Top 0.813: U$2.4 92.47,74.93 89.53,74.93 87,73.66 87,70.48 | 87,70.48 87,64.77 | 87,64.77 87,62.23 | 87,62.23 87,56.52 | C11.1 87,62.23 | C12.1 87,56.52 | C10.1 87,64.77 | R10.2 87,70.48 | 87,56.52 87,36.2 | 87,36.2 87,35.56 85.96,34.53 IC1.28 82.45,34.53 | 87,36.2 v84.45,36.2 | 75.03,34.53 75.02,34.52 v73.15,34.52 71.75,35.92 R1.1
  Bottom 0.813: v84.45,36.2 82.78,34.52 v73.15,34.52
PWRGOOD  (via drill 0.35)
  Top 0.254: v74.3,61.59 75.31,62.62 3V3.P$7 | v77.09,61.59 R7.2
  Bottom 0.254: v74.3,61.59 v77.09,61.59
RINN
  Top 0.406: C3.1 75.92,45.09 76.47,44.57 IC1.11
RINP
  Top 0.406: C4.1 75.34,43.18 75.81,42.7 IC1.12
SHUTDOWN  (via drill 0.35)
  Top 0.406: T3_2.2 90.17,38.1 88.9,39.37 v88.9,46.35 | v84.68,46.41 R15.1
  Bottom 0.406: v88.9,46.35 v84.68,46.41
SPKR_L+
  Top 0.406: IC2.4 51.36,32.38 48.9,32.38 48.26,33.02 48.26,52.07 49.78,53.59 J2.20 65.79,53.59 70.48,48.9 C1.1
SPKR_L-
  Top 0.406: C2.1 71.12,46.99 67.06,51.05 J2.19 55.55,51.05 JMP1.3
SPKR_R+
  Top 0.406: C4.2 71.12,43.18 68.33,45.97 J2.17 50.42,45.97 49.53,45.09 49.53,34.29 50.23,33.59 IC2.5
SPKR_R-
  Top 0.406: C3.2 71.12,45.09 67.69,48.51 J2.18 58.04,48.51 57.35,47.83 JMP1.1
STATE
  Top 0.406: J6.6 6.35,3.79 8.23,1.91 23.5,1.91 24.13,2.54 35.56,2.54 36.2,1.91 85.11,1.91 91.44,8.26 105.41,8.26 107.31,10.16 T3_2.13
UART_RTS
  Top 0.406: J3.8 29.84,23.5
UART_RX
  Top 0.406: T3_2.8 90.78,22.86 89.53,21.54 89.56,7.64 84.45,2.54 40.01,2.54 37.77,4.78 37.8,14.35 36.66,15.49 35.8,15.49 35.31,15.49 | 35.31,15.49 J3.5 | IC2.20 35.81,36.2 35.31,35.69 35.31,15.49
UART_TX  (via drill 0.35)
  Top 0.406: J3.6 v33.66,18.03 33.66,36.2 34.92,37.47 37.42,37.47 | v36.58,18.03 38.73,15.88 38.73,5.08 40.64,3.17 83.82,3.17 88.29,7.59 88.29,24.13 89.56,25.4 T3_2.7
  Top 0.508: IC2.19 37.42,37.47
  Bottom 0.406: v36.58,18.03 v33.66,18.03
VIN
  Top 0.152: 80.26,61.63 R7.1
  Top 0.254: 76.31,69.46 76.58,69.72 | 67.15,74.8 R8.2 | 3V3.P$2 3V3.P$1 76.08,68.08
  Top 0.406: 76.31,72 C7.1 | R8.2 67.68,79.64 67.94,79.91
  Top 0.508: 76.58,69.72 79.12,69.72 80.26,68.58 80.26,61.63
  Top 0.813: 76.31,72 76.31,69.46 76.08,69.22 76.08,68.08 | C7.1 76.22,76.07 72.39,79.91
  Top 1.016: J7.2 43.36,77.55 45.72,79.91 67.94,79.91 72.39,79.91 85.93,79.91 87.3,78.54 U$2.2

### Text on the board
tPlace: 68K | 10uF | 360K | 56K | 39K | NCP59302 | XT-60 Connector | 48K | EN? | 11.1V | 200K | 10K | 1nF | 100nF | 100uF | IND | JB? | 10uF | HC05 | 1uF | 33K | JB? | 1uF | 10K | NC | 3V3 | 33K | 1uF | 39K | Shenzen | Power Amp | 56K | 10R | 220nF | T3.1/T3.2 | >3V3 ONLY< | 33uH | 1uF | R+ | R- | L- | L+ | RN52 | BTS | v1.0 | RN52L | RN52R
bPlace: Working? | REAR | C - 02/2018